# EAGLE design Secondary (EAGLE 5.12)

## Sheet 1 of 3
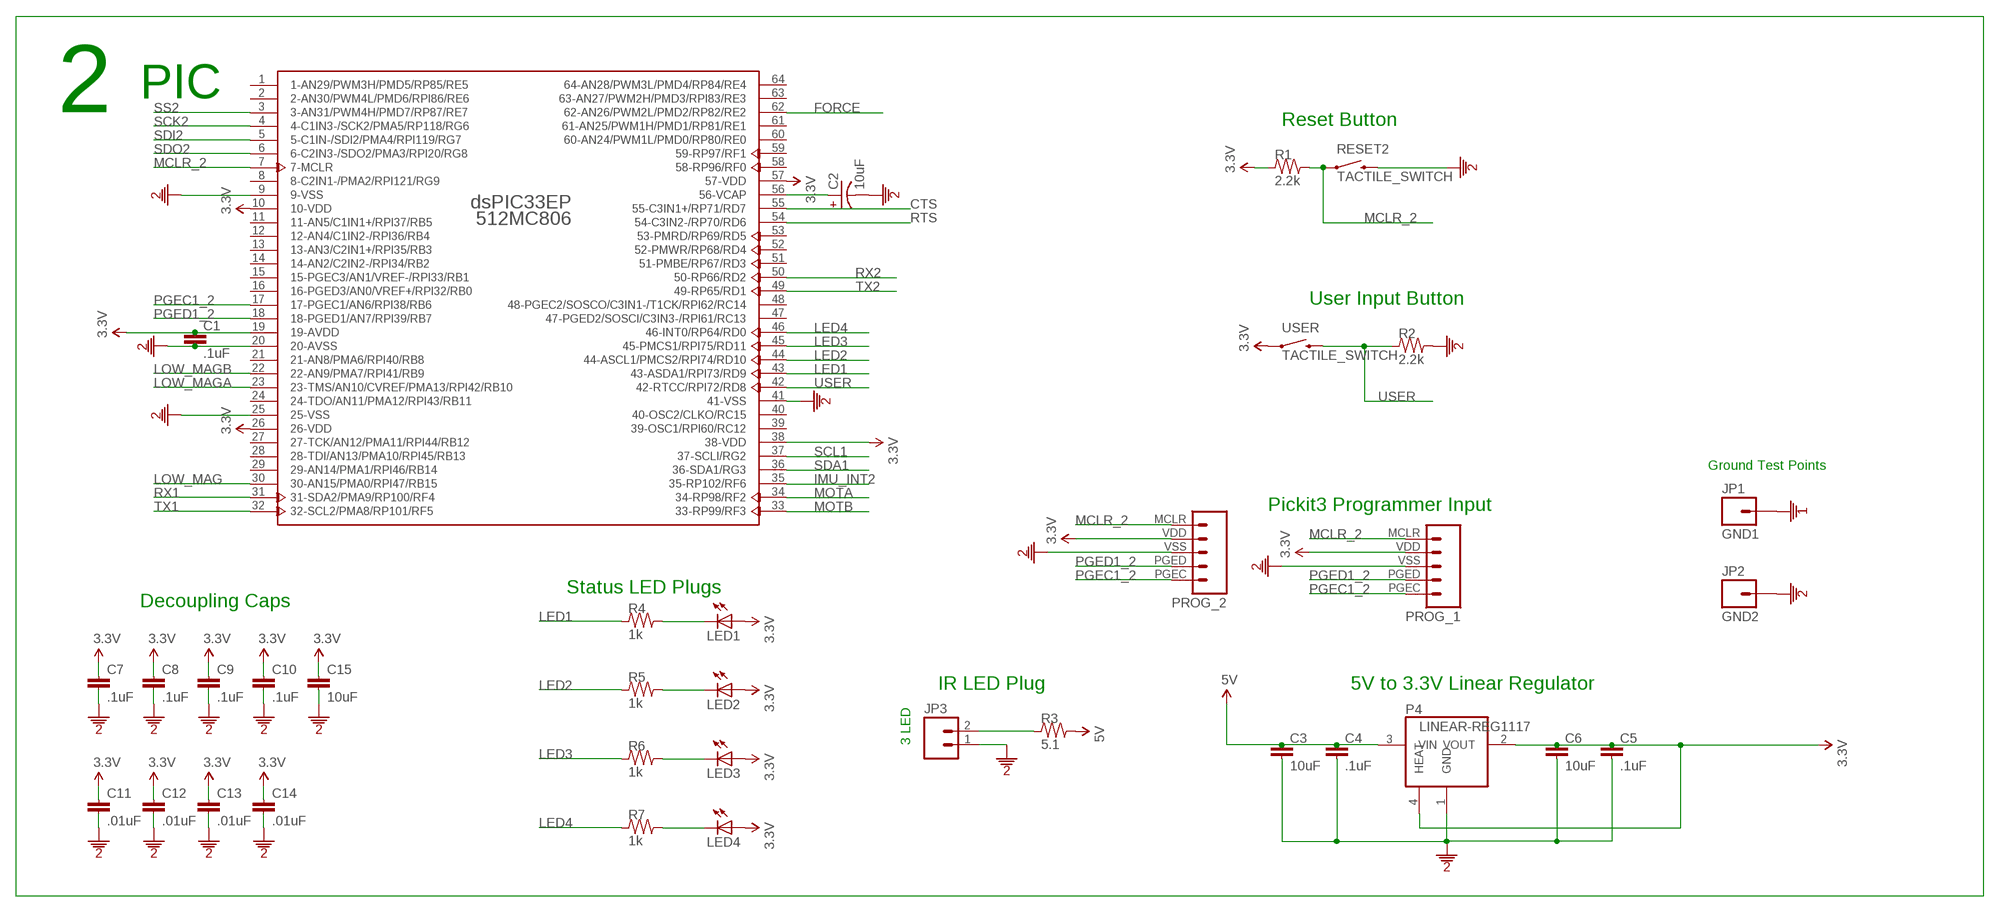
[diagram p0: schematic, sheet 1]

### Parts
C1  .1uF  CAP0603  [0603]
C2  10uF  CAP-POL0603  [0603-POL]
C3  10uF  CAP1206  [1206]
C4  .1uF  CAP0603  [0603]
C5  .1uF  CAP0603  [0603]
C6  10uF  CAP1206  [1206]
C7  .1uF  CAP0603  [0603]
C8  .1uF  CAP0603  [0603]
C9  .1uF  CAP0603  [0603]
C10  .1uF  CAP0603  [0603]
C11  .01uF  CAP0603  [0603]
C12  .01uF  CAP0603  [0603]
C13  .01uF  CAP0603  [0603]
C14  .01uF  CAP0603  [0603]
C15  10uF  CAP1206  [1206]
JP1  GND1  M01PTH  [1X01]
JP2  GND2  M01PTH  [1X01]
JP3  M02JST-PH-V  [JST-2-PH-V]
LED1  LED0603  [0603-DIODE]
LED2  LED0603  [0603-DIODE]
LED3  LED0603  [0603-DIODE]
LED4  LED0603  [0603-DIODE]
P4  LINEAR-REG1117  [SOT223]
PROG_1  M05PICKIT3  [1X05-PICKIT3]
PROG_2  M05PICKIT3  [1X05-PICKIT3]
R1  2.2k  R0603  [0603]
R2  2.2k  R0603  [0603]
R3  5.1  R0603  [0603]
R4  1k  R0603  [0603]
R5  1k  R0603  [0603]
R6  1k  R0603  [0603]
R7  1k  R0603  [0603]
RESET2  TACTILE_SWITCH  [TACTILE_SWITCH]
U$1  DSPIC33EP512MC806  [TQFP64_10X10]
USER  TACTILE_SWITCH  [TACTILE_SWITCH]

### Nets
3.3V: C1.1 C5.1 C6.1 C7.1 C8.1 C9.1 C10.1 C11.1 C12.1 C13.1 C14.1 C15.1 LED1.AN(A) LED2.AN(A) LED3.AN(A) LED4.AN(A) P4.2(VOUT) P4.4(HEAT) PROG_1.VDD PROG_2.VDD R1.1 U$1.10(10-VDD) U$1.19(19-AVDD) U$1.26(26-VDD) U$1.38(38-VDD) U$1.57(57-VDD) USER.1 ; also sheet 2
5V: C3.1 C4.1 P4.3(VIN) R3.2 ; also sheet 2,3
CTS: U$1.55(55-C3IN1+/RP71/RD7) ; also sheet 2
FORCE: U$1.62(62-AN26/PWM2L/PMD2/RP82/RE2) ; also sheet 2
GND1: JP1.1 ; also sheet 2,3
GND2: C1.2 C2.- C3.2 C4.2 C5.2 C6.2 C7.2 C8.2 C9.2 C10.2 C11.2 C12.2 C13.2 C14.2 C15.2 JP2.1 JP3.1 P4.1(GND) PROG_1.VSS PROG_2.VSS R2.2 RESET2.2 U$1.9(9-VSS) U$1.20(20-AVSS) U$1.25(25-VSS) U$1.41(41-VSS) ; also sheet 2,3
IMU_INT2: U$1.35(35-RP102/RF6) ; also sheet 2
LED1: R4.1 U$1.43(43-ASDA1/RPI73/RD9)
LED2: R5.1 U$1.44(44-ASCL1/PMCS2/RPI74/RD10)
LED3: R6.1 U$1.45(45-PMCS1/RPI75/RD11)
LED4: R7.1 U$1.46(46-INT0/RP64/RD0)
LOW_MAG: U$1.30(30-AN15/PMA0/RPI47/RB15) ; also sheet 2
LOW_MAGA: U$1.23(23-TMS/AN10/CVREF/PMA13/RPI42/RB10) ; also sheet 2
LOW_MAGB: U$1.22(22-AN9/PMA7/RPI41/RB9) ; also sheet 2
MCLR_2: PROG_1.MCLR PROG_2.MCLR R1.2 RESET2.1 U$1.7(7-MCLR)
MOTA: U$1.34(34-RP98/RF2) ; also sheet 2
MOTB: U$1.33(33-RP99/RF3) ; also sheet 2
N$2: C2.+ U$1.56(56-VCAP)
N$3: JP3.2 R3.1
N$6: LED4.CAT(C) R7.2
N$7: LED3.CAT(C) R6.2
N$8: LED2.CAT(C) R5.2
N$9: LED1.CAT(C) R4.2
PGEC1_2: PROG_1.PGEC PROG_2.PGEC U$1.17(17-PGEC1/AN6/RPI38/RB6)
PGED1_2: PROG_1.PGED PROG_2.PGED U$1.18(18-PGED1/AN7/RPI39/RB7)
RTS: U$1.54(54-C3IN2-/RP70/RD6) ; also sheet 2
RX1: U$1.31(31-SDA2/PMA9/RP100/RF4) ; also sheet 2
RX2: U$1.50(50-RP66/RD2) ; also sheet 2
SCK2: U$1.4(4-C1IN3-/SCK2/PMA5/RP118/RG6) ; also sheet 2
SCL1: U$1.37(37-SCLI/RG2) ; also sheet 2
SDA1: U$1.36(36-SDA1/RG3) ; also sheet 2
SDI2: U$1.5(5-C1IN-/SDI2/PMA4/RPI119/RG7) ; also sheet 2
SDO2: U$1.6(6-C2IN3-/SDO2/PMA3/RPI20/RG8) ; also sheet 2
SS2: U$1.3(3-AN31/PWM4H/PMD7/RP87/RE7) ; also sheet 2
TX1: U$1.32(32-SCL2/PMA8/RP101/RF5) ; also sheet 2
TX2: U$1.49(49-RP65/RD1) ; also sheet 2
USER: R2.1 U$1.42(42-RTCC/RPI72/RD8) USER.2
Unconnected: U$1.1(1-AN29/PWM3H/PMD5/RP85/RE5) U$1.2(2-AN30/PWM4L/PMD6/RPI86/RE6) U$1.8(8-C2IN1-/PMA2/RPI121/RG9) U$1.11(11-AN5/C1IN1+/RPI37/RB5) U$1.12(12-AN4/C1IN2-/RPI36/RB4) U$1.13(13-AN3/C2IN1+/RPI35/RB3) U$1.14(14-AN2/C2IN2-/RPI34/RB2) U$1.15(15-PGEC3/AN1/VREF-/RPI33/RB1) U$1.16(16-PGED3/AN0/VREF+/RPI32/RB0) U$1.21(21-AN8/PMA6/RPI40/RB8) U$1.24(24-TDO/AN11/PMA12/RPI43/RB11) U$1.27(27-TCK/AN12/PMA11/RPI44/RB12) U$1.28(28-TDI/AN13/PMA10/RPI45/RB13) U$1.29(29-AN14/PMA1/RPI46/RB14) U$1.39(39-OSC1/RPI60/RC12) U$1.40(40-OSC2/CLKO/RC15) U$1.47(47-PGED2/SOSCI/C3IN3-/RPI61/RC13) U$1.48(48-PGEC2/SOSCO/C3IN1-/T1CK/RPI62/RC14) U$1.51(51-PMBE/RP67/RD3) U$1.52(52-PMWR/RP68/RD4) U$1.53(53-PMRD/RP69/RD5) U$1.58(58-RP96/RF0) U$1.59(59-RP97/RF1) U$1.60(60-AN24/PWM1L/PMD0/RP80/RE0) U$1.61(61-AN25/PWM1H/PMD1/RP81/RE1) U$1.63(63-AN27/PWM2H/PMD3/RPI83/RE3) U$1.64(64-AN28/PWM3L/PMD4/RP84/RE4)

### Notes on the sheet
- 2 | PIC
- Reset Button
- User Input Button
- Ground Test Points
- Pickit3 Programmer Input
- Status LED Plugs
- Decoupling Caps
- IR LED Plug | 5V to 3.3V Linear Regulator
- 3 LED

## Sheet 2 of 3
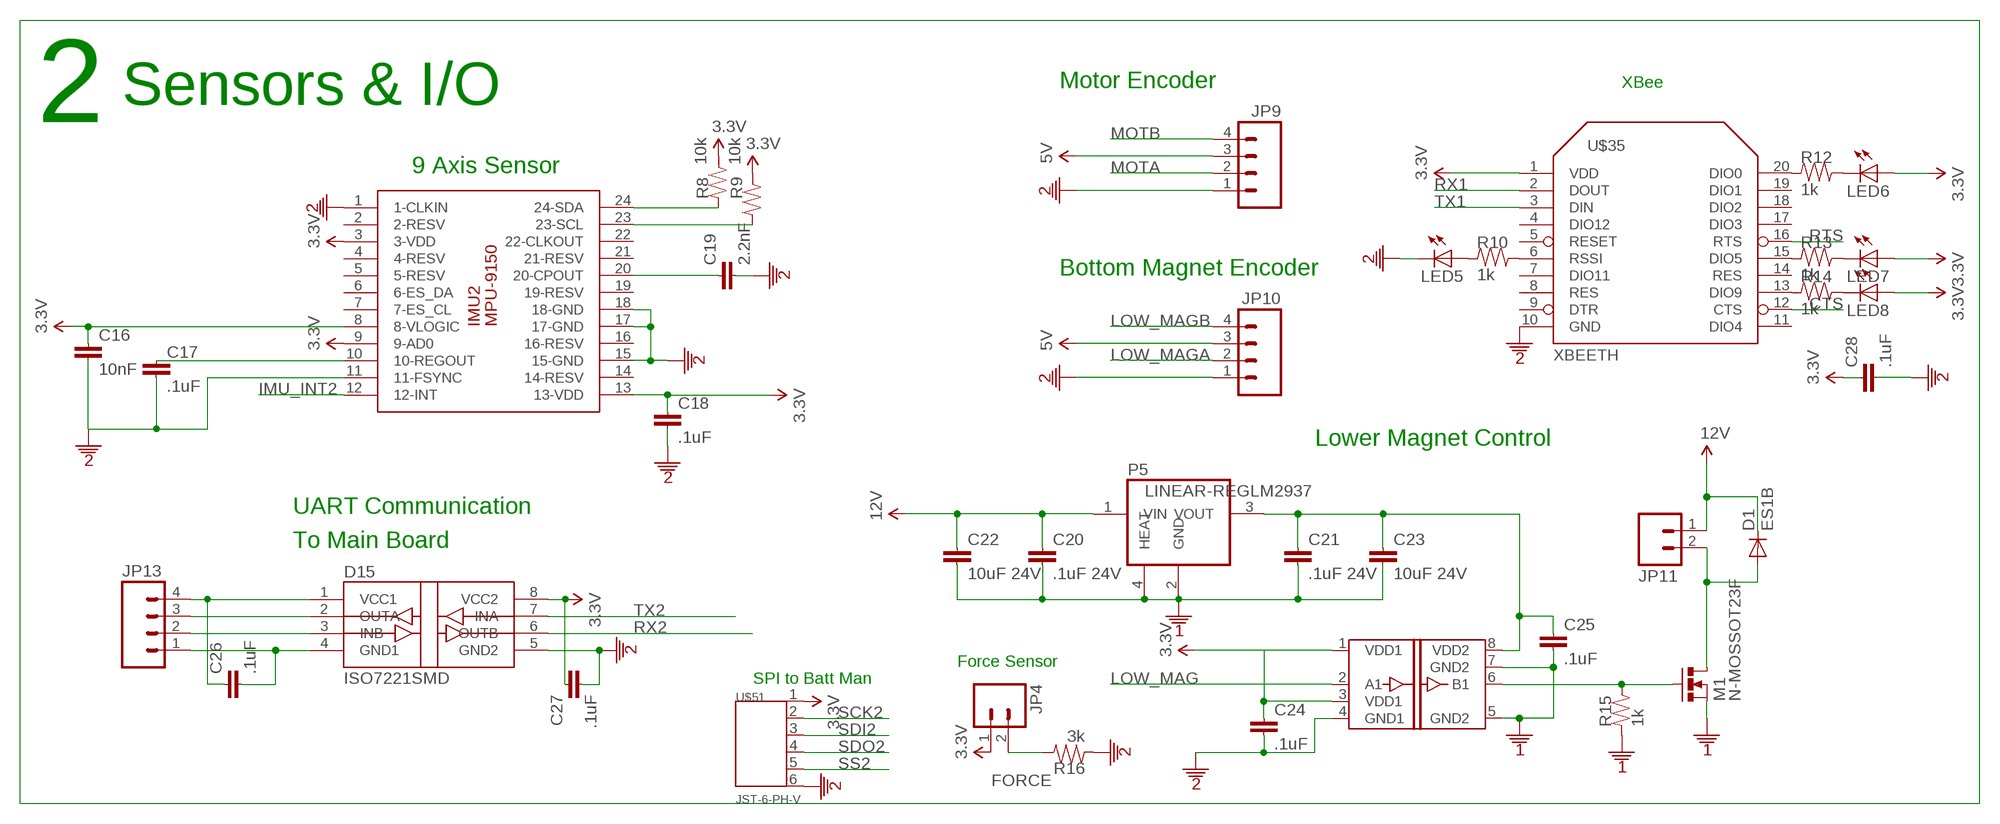
[diagram p1: schematic, sheet 2]

### Parts
C16  10nF  CAP0603  [0603]
C17  .1uF  CAP0603  [0603]
C18  .1uF  CAP0603  [0603]
C19  2.2nF  CAP0603  [0603]
C20  .1uF 24V  CAP0603  [0603]
C21  .1uF 24V  CAP0603  [0603]
C22  10uF 24V  CAP1206  [1206]
C23  10uF 24V  CAP1206  [1206]
C24  .1uF  CAP0603  [0603]
C25  .1uF  CAP0603  [0603]
C26  .1uF  CAP0603  [0603]
C27  .1uF  CAP0603  [0603]
C28  .1uF  CAP1206  [1206]
D1  ES1B  DIODESMA  [SMA-DIODE]
D13  DIGITAL-ISOLATOR-1CHSOIC8-N  [SOIC8-N]
D15  ISO7221SMD  [SOIC-8]
IMU2  MPU-9150  [LGA24_4X4]
JP4  M02JST-PH-V  [JST-2-PH-V]
JP9  M04JST-PH-V  [JST-4-PH-V]
JP10  M04JST-PH-V  [JST-4-PH-V]
JP11  M02JST-PH-V  [JST-2-PH-V]
JP13  M04JST-PH-V  [JST-4-PH-V]
LED5  LED0603  [0603-DIODE]
LED6  LED0603  [0603-DIODE]
LED7  LED0603  [0603-DIODE]
LED8  LED0603  [0603-DIODE]
M1  N-MOSSOT23F  [SOT23F]
P5  LINEAR-REGLM2937  [SOT223]
R8  10k  R0402  [0402]
R9  10k  R0402  [0402]
R10  1k  R0603  [0603]
R12  1k  R0603  [0603]
R13  1k  R0603  [0603]
R14  1k  R0603  [0603]
R15  1k  R0603  [0603]
R16  3k  R0603  [0603]
U$35  XBEETH  [XBEE-SILK]
U$51  JST-6-PH-V  [JST-6-PH-V]

### Nets
3.3V: C16.1 C18.1 C24.1 C27.1 C28.1 D13.1(VDD1) D13.3(VDD1) D15.8(VCC2) IMU2.3(3-VDD) IMU2.8(8-VLOGIC) IMU2.9(9-AD0) IMU2.13(13-VDD) JP4.1 LED6.AN(A) LED7.AN(A) LED8.AN(A) R8.2 R9.2 U$35.1(VDD) U$51.1 ; also sheet 1
5V: JP9.3 JP10.3 ; also sheet 1,3
12V: C20.1 C22.1 D1.C JP11.1 P5.1(VIN) ; also sheet 3
CTS: U$35.12(CTS) ; also sheet 1
FORCE: JP4.2 R16.2 ; also sheet 1
GND1: C20.2 C21.2 C22.2 C23.2 C25.2 D13.5(GND2) D13.7(GND2) M1.S P5.2(GND) P5.4(HEAT) R15.1 ; also sheet 1,3
GND2: C16.2 C17.2 C18.2 C19.2 C24.2 C27.2 C28.2 D13.4(GND1) D15.5(GND2) IMU2.1(1-CLKIN) IMU2.11(11-FSYNC) IMU2.15(15-GND) IMU2.17(17-GND) IMU2.18(18-GND) JP9.1 JP10.1 LED5.CAT(C) R16.1 U$35.10(GND) U$51.6 ; also sheet 1,3
IMU_INT2: IMU2.12(12-INT) ; also sheet 1
LOW_MAG: D13.2(A1) ; also sheet 1
LOW_MAGA: JP10.2 ; also sheet 1
LOW_MAGB: JP10.4 ; also sheet 1
MOTA: JP9.2 ; also sheet 1
MOTB: JP9.4 ; also sheet 1
N$11: C17.1 IMU2.10(10-REGOUT)
N$14: C19.1 IMU2.20(20-CPOUT)
N$15: C21.1 C23.1 C25.1 D13.8(VDD2) P5.3(VOUT)
N$17: D13.6(B1) M1.G R15.2
N$18: D1.A JP11.2 M1.D
N$19: C26.1 D15.1(VCC1) JP13.4
N$20: D15.2(OUTA) JP13.3
N$21: D15.3(INB) JP13.2
N$22: C26.2 D15.4(GND1) JP13.1
N$23: R10.2 U$35.6(RSSI)
N$25: R12.1 U$35.20(DIO0)
N$26: R13.1 U$35.15(DIO5)
N$27: R14.1 U$35.13(DIO9)
N$28: LED5.AN(A) R10.1
N$29: LED6.CAT(C) R12.2
N$30: LED7.CAT(C) R13.2
N$31: LED8.CAT(C) R14.2
RTS: U$35.16(RTS) ; also sheet 1
RX1: U$35.2(DOUT) ; also sheet 1
RX2: D15.6(OUTB) ; also sheet 1
SCK2: U$51.2 ; also sheet 1
SCL1: IMU2.23(23-SCL) R9.1 ; also sheet 1
SDA1: IMU2.24(24-SDA) R8.1 ; also sheet 1
SDI2: U$51.3 ; also sheet 1
SDO2: U$51.4 ; also sheet 1
SS2: U$51.5 ; also sheet 1
TX1: U$35.3(DIN) ; also sheet 1
TX2: D15.7(INA) ; also sheet 1
Unconnected: IMU2.2(2-RESV) IMU2.4(4-RESV) IMU2.5(5-RESV) IMU2.6(6-ES_DA) IMU2.7(7-ES_CL) IMU2.14(14-RESV) IMU2.16(16-RESV) IMU2.19(19-RESV) IMU2.21(21-RESV) IMU2.22(22-CLKOUT) U$35.4(DIO12) U$35.5(RESET) U$35.7(DIO11) U$35.8(RES) U$35.9(DTR) U$35.11(DIO4) U$35.14(RES) U$35.17(DIO3) U$35.18(DIO2) U$35.19(DIO1)

### Notes on the sheet
- Motor Encoder | XBee
- 2 | Sensors & I/O
- 9 Axis Sensor
- Bottom Magnet Encoder
- Lower Magnet Control
- UART Communication
- To Main Board
- Force Sensor
- SPI to Batt Man

## Sheet 3 of 3
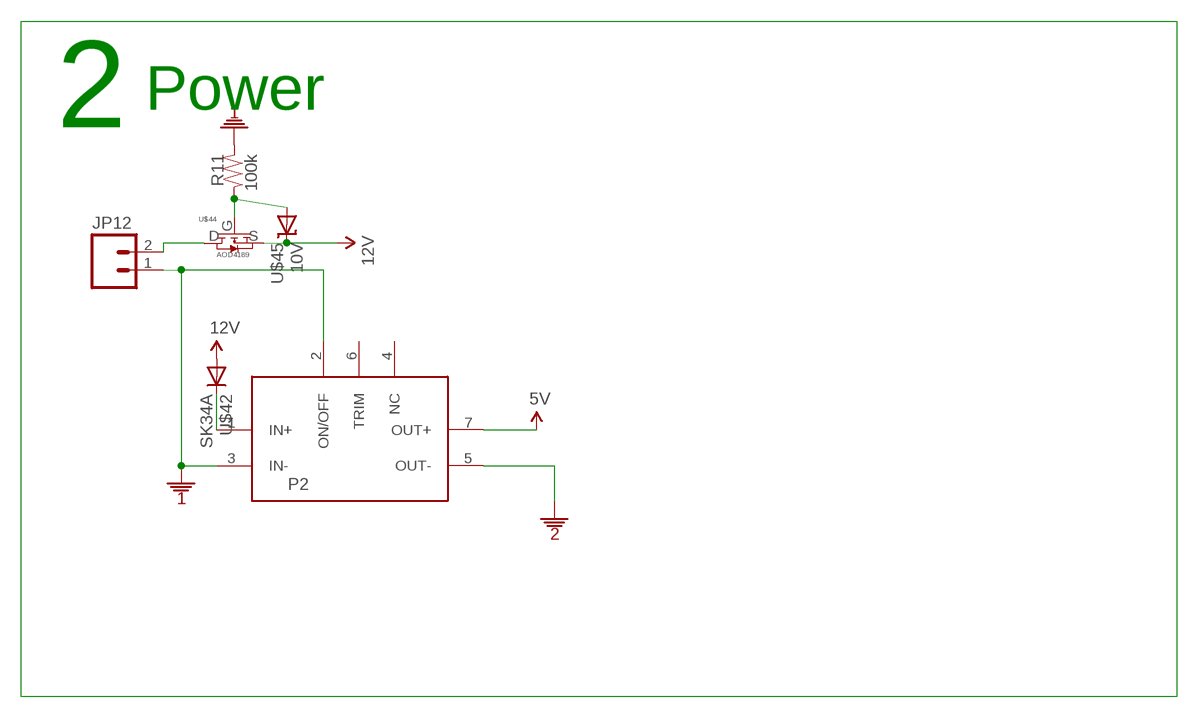
[diagram p2: schematic, sheet 3]

### Parts
JP12  M02JST-PH-V  [JST-2-PH-V]
P2  DC-DC-CONVERTER1.2A  [CC6-2405SF-E]
R11  100k  R0603  [0603]
U$42  SK34A  DIODESMA  [SMA-DIODE]
U$44  AOD4189  [D-PAK]
U$45  10V  DIODE-ZENERSMB  [SMB-DIODE]

### Nets
5V: P2.7(OUT+) ; also sheet 1,2
12V: U$42.A U$44.S U$45.C ; also sheet 2
GND1: JP12.1 P2.2(ON/OFF) P2.3(IN-) R11.1 ; also sheet 1,2
GND2: P2.5(OUT-) ; also sheet 1,2
N$12: P2.1(IN+) U$42.C
N$13: R11.2 U$44.G U$45.A
N$24: JP12.2 U$44.D
Unconnected: P2.4(NC) P2.6(TRIM)

### Notes on the sheet
- 2 | Power

## Library data of the parts
C1 C3-C28 = GibbotV5:CAP: Capacitor Standard 0603 ceramic capacitor, and 0.1" leaded capacitor.
C2 = GibbotV5:CAP-POL: CAPACITOR, American symbol
D1 U$42 = GibbotV5:DIODE: Diode These are standard reverse protection diodes and small signal diodes. SMA package can handle up to about 1A. SOD-323 can handle about 200mA. What the SOD-323 package when ordering, there are some mfgs out there that are 5-pin packages.
D13 = GibbotV5:DIGITAL-ISOLATOR-1CH
D15 = GibbotV6:ISO7221
IMU2 = GibbotV5:MPU-9150
JP1 JP2 = GibbotV5:M01: Header 1 Standard 1-pin 0.1" header. Use with straight break away headers (SKU : PRT-00116), right angle break away headers (PRT-00553), swiss pins (PRT-00743), machine pins (PRT-00117), and female headers (PRT-00115).
JP3 JP4 JP11 JP12 = GibbotV5:M02: Header 2 Standard 2-pin 0.1" header. Use with straight break away headers (SKU : PRT-00116), right angle break away headers (PRT-00553), swiss pins (PRT-00743), machine pins (PRT-00117), and female headers (PRT-00115). Molex polarized connector foot print use with SKU : PRT-08233 with associated crimp pins and housings.
JP9 JP10 JP13 = GibbotV5:M04: Header 4 Standard 4-pin 0.1" header. Use with straight break away headers (SKU : PRT-00116), right angle break away headers (PRT-00553), swiss pins (PRT-00743), machine pins (PRT-00117), and female headers (PRT-00115). Molex polarized connector foot print use with SKU : PRT-08231 with associated crimp pins and housings. 1MM SMD Version SKU: PRT-10208
LED1-LED8 = GibbotV5:LED: LEDs Standard schematic elements and footprints for 5mm, 3mm, 1206, and 0603 sized LEDs. 5mm - Spark Fun Electronics SKU : COM-00529 (and others)
M1 = GibbotV5:N-MOS
P2 = GibbotV5:DC-DC-CONVERTER
P4 P5 = GibbotV5:LINEAR-REG
PROG_1 PROG_2 = GibbotV5:M05: Header 5 Standard 5-pin 0.1" header. Use with straight break away headers (SKU : PRT-00116), right angle break away headers (PRT-00553), swiss pins (PRT-00743), machine pins (PRT-00117), and female headers (PRT-00115). Molex polarized connector foot print use with SKU : PRT-08230 with associated crimp pins and housings.
R1-R16 = GibbotV5:R: RESISTOR, American symbol
RESET2 USER = GibbotV5:TACTILE_SWITCH
U$1 = GibbotV5:DSPIC33EP512MC806
U$35 = GibbotV5:XBEE
U$44 = GibbotV6:AOD4189
U$45 = GibbotV5:DIODE-ZENER: Zener Diode Production Part - 8199 3.4V Zener Voltage
U$51 = GibbotV6:JST-6-PH-V

## Board
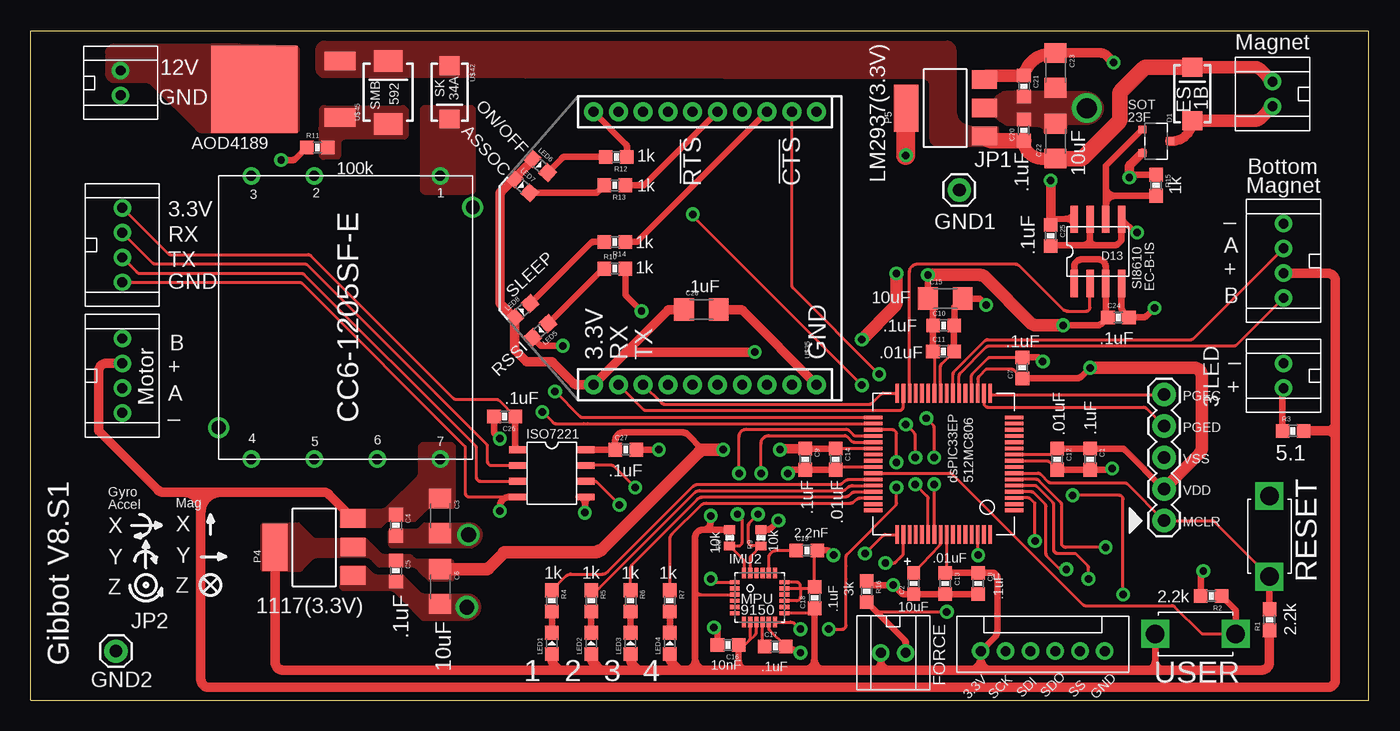
[diagram p3: board, top side]
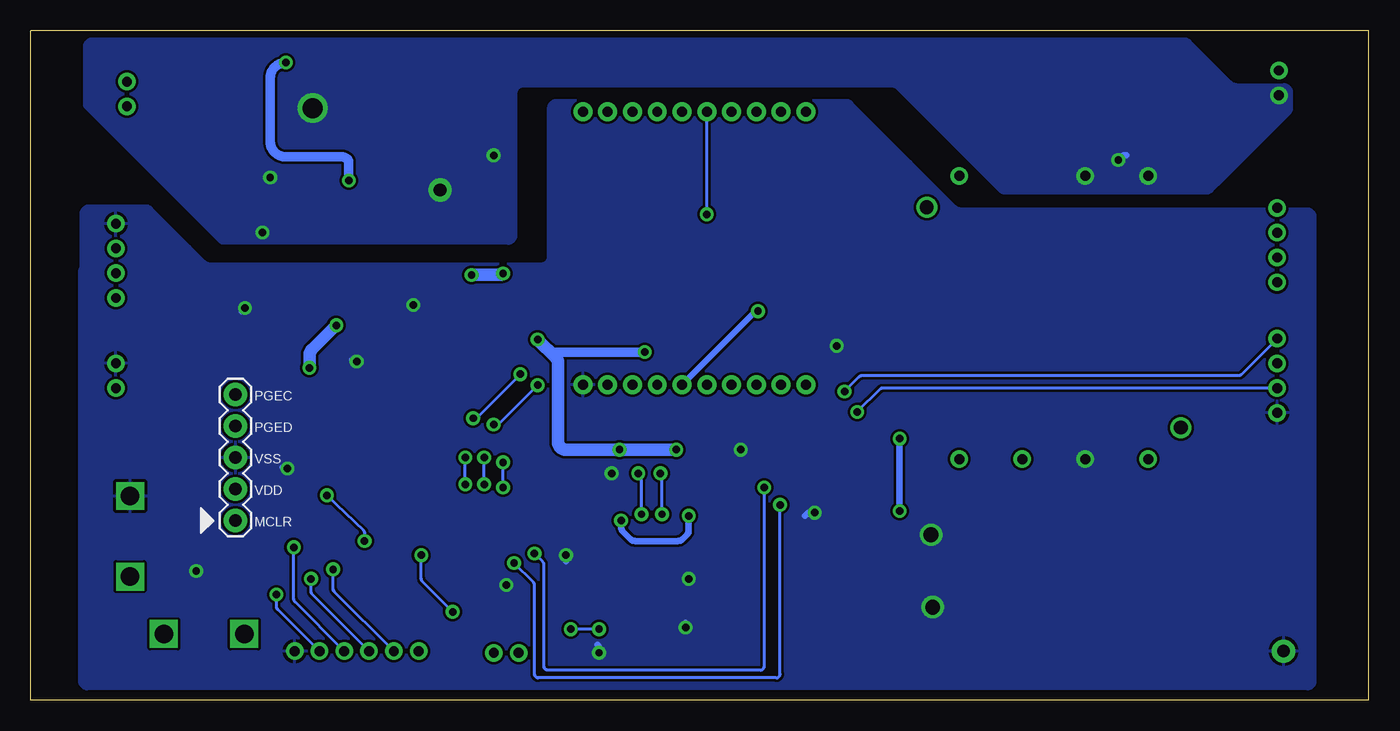
[diagram p4: board, bottom side, seen from below]

Size 107.95 x 53.98 mm. Coordinates in mm from the lower left corner, seen from the top.
Outline: 0,0 0,53.98 107.95,53.98 107.95,0 0,0
Copper layers (1*16): Top 0.035mm / dielectric 1.5mm / Bottom 0.035mm
Design rules "default *": minimum track width 8mil, minimum drill 20mil, track to track 8mil, track to pad 8mil, pad to pad 2mil, via to via 8mil, smd to smd 8mil, copper to edge 10mil, drill to drill 8mil, minimum pad ring 12mil, minimum via ring 10mil, stop-mask expansion 4mil, vias tented up to drill 0mil, thermal gap 10mil

### Footprints (pad centres in the part's own frame; a part is rotated, then mirrored left to right if it is on the bottom)
0603 = smd 1.1 x 1.1: 1 -0.85,0; 2 0.85,0
0603-POL = smd 1.1 x 1: + 0.85,0; - -0.85,0
1206 = smd 1.6 x 1.8: 1 -1.4,0; 2 1.4,0
SMA-DIODE = smd 1.52 x 1.63: A -2.15,0; C 2.15,0
SOIC8-N = smd 2.2 x 0.6: 1 -2.6,1.905; 2 -2.6,0.635; 3 -2.6,-0.635; 4 -2.6,-1.905; 5 2.6,-1.905; 6 2.6,-0.635; 7 2.6,0.635; 8 2.6,1.905
SOIC-8 = smd 1.5 x 0.55: 1 -2.7,1.905; 2 -2.7,0.635; 3 -2.7,-0.635; 4 -2.7,-1.905; 5 2.7,-1.905; 6 2.7,-0.635; 7 2.7,0.635; 8 2.7,1.905
LGA24_4X4 = smd 0.8 x 0.35: 1 -2,1.25; 2 -2,0.75; 3 -2,0.25; 4 -2,-0.25; 5 -2,-0.75; 6 -2,-1.25; 13 2,-1.25; 14 2,-0.75; 15 2,-0.25; 16 2,0.25; 17 2,0.75; 18 2,1.25 | smd 0.35 x 0.85: 7 -1.25,-1.975; 8 -0.75,-1.975; 9 -0.25,-1.975; 10 0.25,-1.975; 11 0.75,-1.975; 12 1.25,-1.975; 19 1.25,1.975; 20 0.75,1.975; 21 0.25,1.975; 22 -0.25,1.975; 23 -0.75,1.975; 24 -1.25,1.975
1X01 = drill 1.016 pad 1.88 round: 1 0,0
JST-2-PH-V = drill 0.8 round: 1 -1,0; 2 1,0
JST-4-PH-V = drill 0.8 round: 1 -3,0; 2 -1,0; 3 1,0; 4 3,0
0603-DIODE = smd 1.1 x 1.1: AN -0.85,0; CAT 0.85,0
SOT23F = smd 0.6 x 0.65: D 0,1.125; G -0.95,-1.125; S 0.95,-1.125
CC6-2405SF-E = drill 0.8 round: 1 -11.43,7.62; 2 -11.43,-2.54; 3 -11.43,-7.62; 4 11.43,-7.62; 5 11.43,-2.54; 6 11.43,2.54; 7 11.43,7.62 | drill 1.1 round: P$9 8.89,-10.25; P$10 -8.89,10.25
SOT223 = smd 1.499 x 2.007: 1 -2.261,-3.15; 2 0.025,-3.15; 3 2.311,-3.15 | smd 3.81 x 2.007: 4 0,3.15
1X05-PICKIT3 = drill 1.016 pad 1.88 round: MCLR 1.27,-1.016; PGEC 11.43,-1.016; PGED 8.89,-1.016; VDD 3.81,-1.016; VSS 6.35,-1.016
0402 = smd 0.7 x 0.9: 1 -0.65,0; 2 0.65,0
TACTILE_SWITCH = drill 1.5 square: 1 -3.25,0; 2 3.25,0
TQFP64_10X10 = smd 1.5 x 0.3: 1 -5.7,3.75; 2 -5.7,3.25; 3 -5.7,2.75; 4 -5.7,2.25; 5 -5.7,1.75; 6 -5.7,1.25; 7 -5.7,0.75; 8 -5.7,0.25; 9 -5.7,-0.25; 10 -5.7,-0.75; 11 -5.7,-1.25; 12 -5.7,-1.75; 13 -5.7,-2.25; 14 -5.7,-2.75; 15 -5.7,-3.25; 16 -5.7,-3.75; 33 5.7,-3.75; 34 5.7,-3.25; 35 5.7,-2.75; 36 5.7,-2.25; 37 5.7,-1.75; 38 5.7,-1.25; 39 5.7,-0.75; 40 5.7,-0.25; 41 5.7,0.25; 42 5.7,0.75; 43 5.7,1.25; 44 5.7,1.75; 45 5.7,2.25; 46 5.7,2.75; 47 5.7,3.25; 48 5.7,3.75 | smd 0.3 x 1.5: 17 -3.75,-5.7; 18 -3.25,-5.7; 19 -2.75,-5.7; 20 -2.25,-5.7; 21 -1.75,-5.7; 22 -1.25,-5.7; 23 -0.75,-5.7; 24 -0.25,-5.7; 25 0.25,-5.7; 26 0.75,-5.7; 27 1.25,-5.7; 28 1.75,-5.7; 29 2.25,-5.7; 30 2.75,-5.7; 31 3.25,-5.7; 32 3.75,-5.7; 49 3.75,5.7; 50 3.25,5.7; 51 2.75,5.7; 52 2.25,5.7; 53 1.75,5.7; 54 1.25,5.7; 55 0.75,5.7; 56 0.25,5.7; 57 -0.25,5.7; 58 -0.75,5.7; 59 -1.25,5.7; 60 -1.75,5.7; 61 -2.25,5.7; 62 -2.75,5.7; 63 -3.25,5.7; 64 -3.75,5.7
XBEE-SILK = drill 0.8 pad 1.524 round: 1 -11,20; 2 -11,18; 3 -11,16; 4 -11,14; 5 -11,12; 6 -11,10; 7 -11,8; 8 -11,6; 9 -11,4; 10 -11,2; 11 11,2; 12 11,4; 13 11,6; 14 11,8; 15 11,10; 16 11,12; 17 11,14; 18 11,16; 19 11,18; 20 11,20
D-PAK = smd 7.01 x 7.01: D 0,0 | smd 1.499 x 2.515: G -2.286,-6.909; S 2.286,-6.909
SMB-DIODE = smd 1.75 x 2.3: A -2.54,0; C 2.54,0
JST-6-PH-V = drill 0.8 round: 1 -5,0; 2 -3,0; 3 -1,0; 4 1,0; 5 3,0; 6 5,0

### Placement (x,y rotation side)
C1  85.47,19.43 270 top
C2  71.25,9.4 90 top
C3  33.02,14.86 270 top
C4  29.46,14.1 270 top
C5  29.46,10.41 270 top
C6  33.02,9.14 270 top
C7  80.01,26.8 90 top
C8  76.45,9.4 270 top
C9  62.48,19.43 270 top
C10  73.66,30.23 0 top
C11  73.65,28.13 0 top
C12  82.8,19.43 270 top
C13  73.79,9.4 270 top
C14  64.95,19.43 270 top
C15  73.79,32.38 0 top
C16  56.26,4.45 180 top
C17  60.07,4.32 0 top
C18  63.25,8.26 90 top
C19  62.61,12.06 0 top
C20  80.14,45.97 90 top
C21  80.14,49.53 270 top
C22  82.68,45.09 90 top
C23  82.68,50.8 270 top
C24  87.76,30.86 0 top
C25  82.3,37.47 270 top
C26  38.23,22.86 180 top
C27  48.01,20.19 0 top
C28  54.1,31.5 0 top
D1  93.73,48.9 90 top
D13  86.11,36.2 90 top
D15  42.04,18.29 0 top
IMU2  58.8,8.26 0 top
JP1  74.93,41.15 0 top
JP2  6.86,3.94 0 top
JP3  101.09,26.16 270 top
JP4  69.6,3.81 0 top
JP9  7.37,26.16 90 top
JP10  101.09,35.43 270 top
JP11  100.2,48.9 270 top
JP12  7.24,49.78 90 top
JP13  7.37,36.7 90 top
LED1  42.04,4.57 90 top
LED2  45.21,4.57 90 top
LED3  48.39,4.57 90 top
LED4  51.56,4.57 90 top
LED5  41.1,29.81 222 top
LED6  41.06,43.12 318 top
LED7  39.63,41.49 318 top
LED8  39.66,31.41 42 top
M1  90.81,45.09 270 top
P2  25.4,30.86 270 top
P4  22.86,12.32 90 top
P5  73.79,47.75 90 top
PROG_1  90.42,13.21 90 top
PROG_2  92.46,13.21 90 bottom
R1  99.95,6.48 90 top
R2  95.25,8.38 180 top
R3  101.85,21.72 0 top
R4  42.04,8 270 top
R5  45.21,8 270 top
R6  48.39,8 270 top
R7  51.56,8 270 top
R8  56.39,13.08 90 top
R9  58.93,13.08 90 top
R10  47.12,34.8 0 top
R11  23.11,44.58 0 top
R12  47.24,43.81 180 top
R13  47.12,41.53 180 top
R14  47.12,36.96 180 top
R15  90.81,41.53 270 top
R16  67.44,8.76 270 top
RESET2  99.95,13.21 90 top
U$1  73.66,19.05 180 top
U$35  65.41,36.45 90 top
U$42  33.78,49.02 270 top
U$44  18.03,49.28 90 top
U$45  28.83,49.02 90 top
U$51  81.66,3.94 0 top
USER  93.98,5.33 0 top

### Tracks (layer width: path | path; a pad name or v marks a point on that pad's centre or on a via)
3.3V  (via drill 0.6)
  Top 0.254: IMU2.8 58.05,5.01 arc-45 57.96,4.78 | 57.11,3.94 57.96,4.78 | IMU2.9 58.55,5.51 arc-45 58.46,5.28 57.96,4.78 | 53.59,9.02 arc90 54.11,8.51 | IMU2.3 53.97,8.51 arc90 53.59,8.13 | U$1.10 82.19,19.8 arc45 82.42,19.89 C12.1 | U$1.26 72.91,27.89 arc45 72.82,28.11 C11.1 | U$1.38 64.99,20.3 arc45 C14.1 | 73.91,10.63 U$1.57 | IMU2.13 62.72,7 arc45 62.94,7.1 C18.1 | U$1.19 76.41,25.86 arc-45 76.5,26.08 77.09,26.67 79.16,26.67 arc-45 79.38,26.58 C7.1
  Top 0.279: 73.91,10.63 arc-45 73.82,10.4 C13.1
  Top 0.508: D15.8 C27.1 47.16,20.95 arc-90 47.79,21.59 52.57,21.59 arc-45 53.02,21.4 54.13,20.29 arc45 54.37,20.19 | 56.26,2.41 arc90 57.11,3.26 | C16.1 57.11,3.94 57.11,3.21 arc90 57.91,2.41 | 62.23,2.41 arc90 63.25,3.43 | C18.1 63.25,3.3 arc90 64.14,2.41 | 54.23,13.73 R8.2 | 54.23,13.73 arc90 53.59,13.1 53.59,9.02 53.59,8.13 53.59,3.43 arc90 54.61,2.41 | 52.7,2.41 arc90 53.59,3.3 | 54.23,13.73 arc90 54.86,14.37 v54.86,14.86 | v60.33,14.48 59.67,13.82 arc-45 59.45,13.73 R9.2 | C9.1 C14.1 | C13.1 C8.1 77.66,10.25 arc-90 77.98,9.93 77.98,5.52 arc-45 77.79,5.07 U$51.1 76.66,3.48 arc90 77.72,2.41 | C12.1 C1.1 88.05,20.28 arc-45 88.27,20.19 PROG_2.VDD | C11.1 72.8,30.2 arc-45 C10.1 72.81,31.83 arc45 72.72,32.05 C15.1 v72.39,34.28 arc-45 v72.39,34.29 | D13.1 84.2,34.92 arc-90 84.84,35.56 86.11,35.56 arc-90 86.74,34.92 D13.3 86.74,31.26 arc45 C24.1 86.46,30.41 arc-45 86.01,30.23 v83.31,30.23 | 89.92,2.41 arc90 90.73,3.23 | USER.1 90.73,3.25 arc90 91.57,2.41 | 67.82,2.41 arc90 68.6,3.19 | JP4.1 68.6,3.29 arc90 69.47,2.41 | 75.56,2.41 arc90 76.66,3.51 | C7.1 84.36,25.95 arc45 84.81,26.13 v85.47,26.8
  Top 0.762: P4.4 19.71,3.05 arc90 20.34,2.41 42.67,2.41 | 42.67,2.41 45.97,2.41 | 45.97,2.41 49.02,2.41 | 49.02,2.41 52.32,2.41 | 52.32,2.41 52.7,2.41 54.61,2.41 56.26,2.41 57.91,2.41 62.23,2.41 64.14,2.41 67.82,2.41 69.47,2.41 75.56,2.41 77.72,2.41 89.92,2.41 91.57,2.41 99.31,2.41 arc90 99.95,3.05 R1.1 | LED1.AN 42.04,3.31 arc45 42.22,2.86 42.67,2.41 | LED2.AN 45.21,3.44 arc45 45.4,2.99 45.97,2.41 | LED3.AN 48.39,3.31 arc45 48.57,2.86 49.02,2.41 | LED4.AN 51.56,3.44 arc45 51.75,2.99 52.32,2.41 | U$35.1 51.36,31.4 arc-45 51.58,31.5 C28.1 | C9.1 60.66,20.28 arc45 v60.45,20.19 | LED6.AN 40.43,43.62 arc-45 40.33,43.4 LED7.AN 37.94,41 arc45 37.85,40.78 37.85,32.15 arc45 37.94,31.93 LED8.AN 39.02,28.42 arc45 39.12,28.19 40.01,27.3 41.91,27.3 arc-45 42.13,27.21 43.8,25.54 arc45 44.02,25.45 U$35.1 | U$35.1 47.93,27.97 arc-45 48.15,28.07 v58.42,28.07
  Top 1.016: C6.1 36.7,10.54 arc45 36.93,10.64 38.13,11.85 arc-45 38.36,11.94 45.59,11.94 arc45 45.81,12.03 arc45 46.03,12.12 53.92,20.01 arc-45 54.37,20.19 v55.88,20.19 | v67.06,29.08 69.66,31.69 arc45 69.85,32.14 v69.85,34.42 | v85.47,26.8 93.85,26.8 arc-90 94.49,26.16 94.49,20.33 arc-45 94.3,19.88 PROG_2.VDD | v83.31,30.23 81.16,30.23 arc-45 80.71,30.41 77.02,34.1 arc45 76.57,34.29 v72.39,34.29
  Bottom 0.508: v54.86,14.86 54.86,13.72 arc45 55.05,13.28 55.31,13.01 arc45 55.76,12.83 59.17,12.83 arc45 59.62,13.01 60.14,13.53 arc45 60.33,13.98 v60.33,14.48
  Bottom 0.762: v58.42,28.07 65.91,28.07 arc45 66.13,28.16 v67.06,29.08
  Bottom 1.016: v67.06,29.08 65.59,27.62 arc45 65.41,27.17 65.41,20.83 arc-90 64.77,20.19 v60.45,20.19 v55.88,20.19 | v83.31,30.23 85.28,28.25 arc-45 85.47,27.8 v85.47,26.8 | v69.85,34.42 arc45 70.16,34.29 v72.39,34.29
  pour Top (no thermals): 19.18,14.22 21.46,14.22 arc-45 21.68,14.13 22.35,13.46 22.77,13.05 arc45 22.99,12.95 25.53,12.95 26.92,12.95 arc-45 27.14,12.86 27.56,12.45 28.23,11.78 arc45 28.45,11.68 29.34,11.68 30.48,11.68 arc-45 30.7,11.59 30.73,11.56 30.89,11.4 arc45 31.12,11.3 33.27,11.3 33.78,11.3 arc-90 34.04,11.05 34.04,9.78 arc-90 33.91,9.65 32.26,9.65 arc-45 32.04,9.74 31.62,10.16 31.08,10.7 arc45 30.86,10.79 29.59,10.79 28.2,10.79 arc-45 27.97,10.89 27.81,11.05 27.4,11.46 arc45 27.17,11.56 26.29,11.56 22.99,11.56 arc45 22.77,11.46 22.23,10.92 21.81,10.51 arc-45 21.59,10.41 20.19,10.41 18.8,10.41 arc-90 18.67,10.54 18.67,14.1 arc-90 18.8,14.22
5V
  Top 0.762: JP9.3 6.1,27.16 arc90 5.46,26.53 5.46,21.72 10.23,16.95 arc45 10.68,16.76 12.32,16.76 | 12.32,16.76 15.37,16.76 | 15.37,16.76 23.61,16.76 arc-45 24.06,16.58 P4.3 | 105.28,21.08 arc90 104.65,21.72 | 105.28,21.08 105.28,1.65 arc-90 104.65,1.02 14.35,1.02 arc-90 13.72,1.65 13.72,15.37 arc90 12.32,16.76 | 15.37,16.76 arc90 13.72,15.11 | JP10.3 104.65,34.43 arc-90 105.28,33.8 105.28,22.35 | 105.28,21.08 105.28,22.35 | 104.65,21.72 R3.2 | 104.65,21.72 arc90 105.28,22.35
  pour Top (no thermals): 33.02,20.7 33.85,20.7 arc-90 34.16,20.38 34.16,16.38 34.16,15.75 arc-90 33.91,15.49 32.14,15.49 arc45 31.91,15.4 31.5,14.99 31.08,14.57 arc-45 30.86,14.48 29.46,14.48 28.83,14.48 arc45 28.61,14.38 28.57,14.35 28.29,14.06 arc-45 28.06,13.97 26.54,13.97 25.02,13.97 25.02,15.24 arc-90 25.15,15.37 28.44,15.37 arc45 28.67,15.46 28.83,15.62 31.28,18.07 arc45 31.37,18.29 31.37,19.18 31.37,20.38 arc-90 31.69,20.7 32.51,20.7
12V
  Top 1.016: C20.1 arc90 81.58,43.69 C22.1 | D1.C 98.79,51.05 arc-45 99.24,50.86 JP11.1
  Top 1.27: D1.C arc45 93.7,51.05 90.05,51.05 arc45 89.82,50.96 87.98,49.12 arc45 87.88,48.89 87.88,46.87 arc-45 87.79,46.64 84.93,43.78 arc-45 84.7,43.69 C22.1 | P5.1 77.12,45.31 arc45 77.57,45.12 C20.1
  pour Top (no thermals): 75.95,46.23 77.85,46.23 arc-90 77.98,46.1 77.98,44.96 arc-90 77.72,44.7 73.28,44.7 arc-90 72.64,45.34 72.64,49.53 arc90 72.01,50.16 23.75,50.29 arc-90 23.11,50.8 23.11,52.58 arc-90 23.75,53.09 73.91,53.09 arc-90 74.55,52.45 74.55,47.62 arc90
CTS  (via drill 0.6)
  Top 0.254: v72.9,19.56 72.9,21.97 arc45 72.81,22.19 v72.26,22.73 | v68.45,26.29 61.5,33.24 arc-45 61.41,33.47 U$35.12 | U$1.55 72.91,17.37 arc45 v72.9,17.4
  Bottom 0.254: v72.9,17.4 v72.9,19.56 | v72.26,22.73 72.14,22.73 arc-45 71.92,22.83 v68.45,26.29
FORCE  (via drill 0.6)
  Top 0.254: R16.2 68.14,7.21 arc45 68.37,7.11 v73.91,7.11 | v76.45,11.68 arc-45 76.41,11.79 U$1.62
  Top 0.508: JP4.2 70.6,4.62 arc45 70.5,4.85 R16.2
  Bottom 0.254: v73.91,7.11 76.36,9.56 arc45 76.45,9.78 v76.45,11.68
GND1  (via drill 0.6, 1.6)
  Top 0.508: v89.28,37.72 89.09,37.72 D13.5 88.01,37.21 arc-90 87.38,36.7 85.85,36.7 | C25.2 82.3,36.7 84.96,36.7 | 84.96,36.7 85.85,36.7 | 84.96,36.7 arc90 85.47,37.21 | D13.7 85.47,37.08 arc90 85.85,36.7 | R11.1 21.34,43.65 arc-45 21.12,43.56 v20.19,43.56 | R15.1 88.86,42.38 arc90 v88.65,42.16
  Top 0.762: v88.65,42.16 88.65,42.97 arc-45 88.74,43.19 M1.S
  Top 1.524: P5.4 70.61,47.75 v70.61,43.94
  Bottom 0.508: v20.19,43.56 19.91,43.85 arc45 19.68,43.94 19.56,43.94
  other vias: 85.22,47.75
  pour Top (no thermals): 84.71,49.02 arc-90 86.49,47.75 arc-90 84.96,46.48 83.31,46.48 83.31,49.02
  pour Top (no thermals): 82.04,49.02 78.87,49.02 arc90 77.6,47.75 arc90 78.99,46.61 82.04,46.48
  pour Top (no thermals): 81.41,49.02 83.95,49.02 83.95,46.48 81.41,46.48
  pour Top (no thermals): 77.34,48.39 76.42,48.39 arc90 76.2,48.17 76.2,47.45 arc90 76.39,47.26 77.62,47.26 arc-90 78.23,47.16 arc90 78.93,46.46 81.33,46.33 arc-90 81.83,45.83 83.52,45.83 arc-90 83.53,45.82 83.53,46.23 arc-90 83.85,46.55 83.85,48.51 arc90 83.45,48.91 83.45,49.96 arc90 83.43,49.99 81.93,49.99 arc-90 81.89,50.03 81.89,49.26 arc-90 81.57,48.95 78.55,48.95 arc90 78.16,48.55 78.16,48.45 arc-90 77.95,48.25
  pour Bottom (no thermals): 7.24,49.66 6.86,49.66 arc90 6.22,49.02 6.22,47.88 6.22,47.76 arc45 6.41,47.31 11.81,41.91 12.64,41.08 arc45 13.09,40.89 24.64,40.89 29.33,40.89 arc45 29.78,41.08 34.04,45.34 38.04,49.34 arc-45 38.49,49.53 64.64,49.53 68.2,49.53 arc-90 68.83,48.9 68.83,43.56 68.83,37.47 arc90 69.47,36.83 85.09,36.83 92.32,36.83 arc45 92.77,37.02 97.54,41.78 103.45,47.69 arc45 103.63,48.14 103.63,49.4 103.63,52.7 arc90 103,53.34 97.92,53.34 14.87,53.34 arc45 14.42,53.15 12.19,50.93 11.11,49.84 arc-45 10.66,49.66 7.75,49.66
GND2  (via drill 0.6, 1.2)
  Top 0.254: IMU2.11 59.55,5.82 arc45 59.64,5.59 C17.2 | IMU2.1 55.27,9.51 arc-45 55.05,9.6 v54.86,9.78 | IMU2.17 62.1,9.01 | 62.1,9.01 63.01,9.01 arc45 C18.2 63.25,11.72 arc-45 63.34,11.94 C19.2 | IMU2.15 61.78,8.01 arc90 62.1,8.32 62.1,9.01 | IMU2.18 61.78,9.51 arc-90 62.1,9.19 62.1,9.01 | U$1.9 81.95,19.3 arc-45 82.18,19.21 C12.2 | U$1.41 65.3,18.8 arc45 65.07,18.71 C14.2 | U$1.25 73.41,26.91 arc-45 73.5,27.14 C11.2 | U$1.20 75.91,26.12 arc-45 76,26.35 77.21,27.55 arc-45 77.44,27.65 C7.2
  Top 0.508: C27.2 v50.67,20.19 | v44.7,15.11 arc45 44.74,15.19 44.74,15.91 arc-90 45.21,16.38 D15.5 | D15.5 44.2,16.38 arc-90 44.7,15.88 44.7,15.62 arc90 44.74,15.65 D15.5 | D13.4 88.01,31.72 arc45 88.2,31.27 C24.2 89.65,30.86 arc45 90.1,31.05 v90.68,31.62 | C17.2 arc45 60.99,4.35 v62.1,3.81 | C19.2 64.26,12.06 arc-45 64.48,11.97 v64.77,11.68 | C8.2 C13.2 C2.- 70.45,8.55 arc-45 70.23,8.64 v69.6,9.27 67.91,9.27 arc-45 67.69,9.36 R16.1 | C12.2 C1.2 87.04,18.58 arc45 v87.25,18.67 | C11.2 74.5,30.2 arc-45 C10.2 74.51,31.58 arc-45 74.6,31.8 C15.2 76.45,32.38 arc-45 76.67,32.29 v77.09,31.88 | C16.2 55.41,5.42 arc45 55.32,5.64 v55.12,5.84 | v61.09,18.29 61.29,18.49 arc-45 61.51,18.58 C9.2 C14.2 | R2.2 94.4,10.07 arc-45 94.49,10.29 v94.61,10.41 | C7.2 81.19,27.65 arc-45 81.41,27.55 v81.66,27.3 | LED5.CAT 41.04,28.67 arc45 41.26,28.57 v42.93,28.57
  Top 0.762: C28.2 57.23,31.5 arc-45 57.45,31.4 U$35.10
  Bottom 0.254: v54.86,9.78 arc45 54.77,10 54.61,10.16
  Bottom 0.508: v50.67,20.19 50.67,20.32 | v44.7,15.11 45.08,15.11 arc-45 45.3,15.02 45.47,14.86 | v90.68,31.62 90.93,31.37 | v62.1,3.81 arc-45 62.19,4.41 62.23,4.45 | v64.77,11.68 64.77,11.18 | v87.25,18.67 87.37,18.67 arc45 87.6,18.76 87.63,18.8 | v55.12,5.84 55.12,6.22 | v61.09,18.29 61.09,18.16 | v94.61,10.41 arc-45 94.83,10.32 94.87,10.29 | v69.6,9.27 69.6,9.4 | v77.09,31.88 arc-45 77,31.66 76.96,31.62 | v81.66,27.3 81.78,27.3 arc45 82.01,27.4 82.04,27.43 | v42.93,28.57 42.96,28.61 arc-45 43.18,28.7
  other vias: 35.31,13.34 35.18,7.49
  pour Bottom (no thermals): 21.72,20.57 24,20.57 24,18.29 21.72,18.29
  pour Bottom: 15.11,39.62 4.95,39.62 arc90 4.32,38.99 4.32,37.21 4.32,1.52 arc90 4.95,0.89 12.06,0.89 103.38,0.89 arc90 104.01,1.52 104.01,14.35 104.01,34.54 arc90 103.38,35.18 89.53,35.18 66.8,35.18 arc-90 66.17,35.81 66.17,40.64 66.17,47.75 arc90 65.53,48.39 47.62,48.39 42.17,48.39 arc45 41.72,48.2 36.96,43.43 33.33,39.81 arc-45 32.88,39.62 15.49,39.62
  pour Bottom: 103.89,30.48 103.89,39.24 arc90 103.25,39.88 101.35,39.88 98.69,39.88 arc45 98.24,39.69 95.12,36.58 93.91,35.37 arc-45 93.46,35.18 89.15,35.18 93.67,30.67 arc45 94.12,30.48 102.87,30.48
  pour Top (no thermals): 29.34,13.72 31.11,13.72 arc45 31.34,13.81 31.37,13.84 31.66,14.13 arc-45 31.88,14.22 33.4,14.22 35.43,14.22 arc-90 36.32,13.34 arc-90 35.31,12.32 29.21,12.32 arc-90 28.96,12.57 28.96,13.59 arc-90 29.08,13.72
  pour Top (no thermals): 25.78,10.79 26.79,10.79 arc-45 27.02,10.7 27.3,10.41 27.59,10.13 arc45 27.82,10.03 29.34,10.03 29.84,10.03 arc-45 30.07,9.94 30.99,9.02 31.4,8.6 arc45 31.63,8.51 33.02,8.51 35.18,8.51 arc-90 36.2,7.49 arc-90 35.18,6.48 31.75,6.48 arc-45 31.53,6.57 30.1,8 29.3,8.8 arc45 29.08,8.89 26.54,8.89 25.27,8.89 arc-90 25.02,9.14 25.02,10.67 arc-90 25.15,10.79
IMU_INT2  (via drill 0.6)
  Top 0.254: IMU2.12 61.27,6.28 arc-45 61.72,6.09 v62.1,5.71 | U$1.35 69.53,21.8 arc-90 69.85,21.48 v69.85,19.18 | v69.85,17.14 69.85,15.88 arc-45 69.76,15.65 65.88,11.78 arc45 65.79,11.55 65.79,10.79 65.79,9.78 65.79,6.03 arc-90 65.47,5.71 v64.39,5.71
  Bottom 0.254: v62.1,5.71 v64.39,5.71 | v69.85,17.14 v69.85,19.18
LED1
  Top 0.254: U$1.43 66.07,17.8 arc45 65.62,17.61 65.53,17.53 arc-45 65.22,17.4 53.86,17.4 arc45 53.41,17.21 46.54,10.35 arc-45 46.09,10.16 43.61,10.16 arc45 43.16,9.97 R4.1
LED2
  Top 0.254: U$1.44 66.33,17.3 arc45 65.88,17.11 65.79,17.02 arc-45 65.48,16.89 53.98,16.89 arc45 53.53,16.7 45.87,9.04 arc-45 45.42,8.85 R5.1
LED3
  Top 0.254: U$1.45 66.56,16.8 arc45 66.17,16.64 66.1,16.57 arc-45 65.65,16.38 54.24,16.38 arc45 53.79,16.2 48.57,10.98 arc45 48.39,10.53 R6.1
LED4
  Top 0.254: U$1.46 66.98,16.3 arc45 66.53,16.11 66.42,16 arc-45 66.11,15.88 54.49,15.88 arc45 54.04,15.69 51.75,13.39 arc45 51.56,12.95 R7.1
LOW_MAG
  Top 0.254: D13.2 85.47,31.69 arc-90 85.15,31.37 83.7,31.37 arc-45 83.25,31.55 79.81,34.99 arc45 79.37,35.18 71.55,35.18 arc90 70.91,34.54 U$1.30
LOW_MAGA
  Top 0.254: U$1.23 74.41,26.27 arc-45 74.5,26.5 77,28.99 arc-45 77.22,29.08 93.61,29.08 arc45 93.83,29.18 JP10.2
LOW_MAGB
  Top 0.254: U$1.22 74.91,26.14 arc-45 75,26.36 77.12,28.48 arc-45 77.35,28.57 97.1,28.57 arc45 97.33,28.67 JP10.4
MCLR_2
  Top 0.254: U$1.7 81.26,18.3 arc-45 81.49,18.21 82.08,17.62 arc45 82.3,17.53 88.26,17.53 arc-45 88.48,17.43 PROG_2.MCLR 95.3,14.48 arc-45 95.52,14.38 RESET2.1
  Top 0.508: RESET2.1 R1.2
MOTA  (via drill 0.6)
  Top 0.254: U$1.34 44.96,22.3 44.63,22.3 42.35,22.3 arc-45 42.12,22.39 v41.27,23.24
  Bottom 0.254: JP9.2 39.22,25.16 arc-45 39.45,25.07 v41.27,23.24
MOTB  (via drill 0.6)
  Top 0.254: v42.29,24.89 44.29,22.89 arc45 44.51,22.8 U$1.33
  Bottom 0.254: JP9.4 10.27,26.25 arc45 10.5,26.16 40.89,26.16 arc-45 41.11,26.07 v42.29,24.89
N$2
  Top 0.254: U$1.56 73.41,12.67 arc-45 73.32,12.45 C2.+
N$3
  Top 0.508: JP3.2 arc45 101,24.95 R3.1
N$6
  Top 0.508: LED4.CAT R7.2
N$7
  Top 0.508: LED3.CAT R6.2
N$8
  Top 0.508: LED2.CAT R5.2
N$9
  Top 0.508: LED1.CAT R4.2
N$11
  Top 0.254: IMU2.10 59.05,4.62 arc45 59.14,4.39 C17.1
N$12
  pour Top (no thermals): 33.66,47.88 31.81,47.88 arc90 31.5,47.56 31.5,43.56 31.5,41.21 arc90 31.81,40.89 32.77,40.89 35.5,40.89 arc90 35.81,41.21 35.81,44.07 35.81,47.56 arc90 35.5,47.88 34.16,47.88
N$13
  pour Top (no thermals): 23.75,47.88 29.97,47.88 arc-90 30.35,47.5 30.35,45.59 arc-90 30.1,45.34 25.4,45.34 arc90 24.89,44.83 24.89,43.94 arc-90 24.64,43.69 23.62,43.69 arc-90 23.37,43.94 23.37,45.85 arc90 23.62,45.97 23.37,45.97 arc-90 23.37,46.23 23.37,47.62 arc-90
N$14
  Top 0.254: IMU2.20 59.55,11.43 arc-90 60.19,12.06 C19.1
  Top 0.762: C19.1 61.72,12.06 arc-90 61.59,12.19
N$15  (via drill 0.6)
  Top 0.508: C25.1 82.3,38.73 arc-90 82.36,38.8 83.54,38.82 arc90 84.23,39.51 84.23,38.14 arc-90 84.2,38.09 84.15,38.34 arc90 83.6,38.81 84.19,38.81 arc-90 D13.8
  Top 0.762: 82.36,38.8 arc-90 82.3,38.85 v82.3,41.91 | C23.1 86.35,52.2 arc-45 86.8,52.01 v87.38,51.44
  Top 1.016: P5.3 arc-90 77.25,50.38 C21.1 arc-90 82.85,52.07 C23.1
  Bottom 0.762: v87.38,51.44 arc-90 88.65,50.16 88.65,45.09 arc-90 87.38,43.81 82.8,43.81 arc90 82.3,43.31 v82.3,41.91
N$17
  Top 0.508: D13.6 86.74,39.88 | 86.74,39.88 86.74,41.4 | 86.74,41.4 86.74,42.97 arc-45 86.83,43.19 M1.G | 86.74,41.4 arc90 87.46,40.68 | R15.2 87.54,40.68 arc90 86.74,39.88
N$18
  Top 0.762: M1.D 92.07,45.09 arc90 D1.A
  Top 1.016: D1.A 98.79,46.74 arc45 99.24,46.93 JP11.2
N$19
  Top 0.254: JP13.4 11.04,36.03 arc45 11.26,35.94 22.35,35.94 arc-45 22.57,35.85 34.07,24.35 arc45 34.29,24.26 37.55,24.26 arc-45 37.77,24.16 C26.1
  Top 0.508: C26.1 39.08,20.58 arc45 39.17,20.36 D15.1
N$20
  Top 0.254: JP13.3 9.8,35.27 arc45 10.02,35.18 22.09,35.18 arc-45 22.32,35.09 36.74,20.67 arc-45 36.83,20.44 36.83,19.24 arc90 37.15,18.92 D15.2
N$21
  Top 0.254: JP13.2 8.56,34.51 arc45 8.78,34.42 21.84,34.42 arc-45 22.06,34.32 35.85,20.54 arc-45 35.94,20.32 35.94,17.97 arc90 36.26,17.65 D15.3
N$22  (via drill 0.6)
  Top 0.254: D15.4 38.61,16.38 35.37,16.38 arc-90 35.05,16.7 35.05,20.45 21.89,33.61 arc45 21.66,33.7 JP13.1
  Top 0.508: C26.2 37.38,21.68 arc45 37.47,21.46 v37.85,21.08 | v37.85,15.24 37.85,15.62 arc-90 38.61,16.38
  Bottom 0.508: v37.85,15.24 v37.85,21.08
N$23  (via drill 0.6)
  Top 0.508: R10.2 47.97,32.81 arc45 48.06,32.59 v49.28,31.37
  Bottom 0.508: v49.28,31.37 49.35,31.37 arc-45 49.58,31.28 U$35.6
N$24
  pour Top (no thermals): 16.89,52.83 6.73,52.83 arc90 6.1,52.2 6.1,50.55 arc90 6.73,49.91 9.26,49.91 arc-45 9.71,49.73 13.4,46.03 arc45 13.85,45.85 21.21,45.85 arc90 21.59,45.97 21.59,52.45 arc90 21.21,52.7
N$25
  Top 0.508: U$35.20 48,44.85 arc-45 48.09,44.63 R12.1
N$26
  Top 0.508: R13.1 49.35,41.53 arc45 49.58,41.62 U$35.15
N$27
  Top 0.508: R14.1 48.78,36.96 arc45 49.01,37.05 U$35.13
N$28
  Top 0.508: LED5.AN 46.08,34.72 arc-45 R10.1
N$29
  Top 0.508: LED6.CAT 42.86,43.72 arc-45 43.08,43.81 R12.2
N$30
  Top 0.508: LED7.CAT 45.53,40.92 arc45 45.75,41.01 R13.2
N$31
  Top 0.508: LED8.CAT 45.17,36.86 arc-45 45.4,36.96 R14.2
PGEC1_2
  Top 0.254: PROG_2.PGEC 77.52,24.64 arc-90 U$1.17
PGED1_2
  Top 0.254: PROG_2.PGED 90.01,23.53 arc45 89.78,23.62 77.23,23.62 arc-90 76.91,23.94 U$1.18
RTS  (via drill 0.6)
  Top 0.254: v71.37,19.56 71.37,21.33 arc45 71.28,21.56 v70.61,22.23 | v67.06,25.4 53.5,38.96 arc-45 v53.41,39.18 | U$1.54 72.41,16.23 arc45 72.32,16.46 v71.37,17.4
  Bottom 0.254: v71.37,17.4 v71.37,19.56 | v70.61,22.23 70.36,22.23 arc-45 70.14,22.32 v67.06,25.4 | v53.41,39.18 U$35.16
RX1
  Top 0.254: U$1.31 70.41,23.69 arc-90 70.09,23.37 49.62,23.37 arc-45 49.39,23.46 U$35.2
RX2  (via drill 0.6)
  Top 0.254: U$1.50 70.41,11.87 arc-45 70.32,11.64 70.23,11.56 70.1,11.43 69.82,11.14 arc-45 69.59,11.05 v68.96,11.05 | D15.6 45.46,17.65 arc-45 45.69,17.56 v47.5,15.75
  Bottom 0.254: v47.5,15.75 47.5,2.1 arc90 47.82,1.78 66.99,1.78 arc90 67.31,2.1 67.31,9.27 arc-45 67.4,9.49 v68.96,11.05
SCK2  (via drill 0.6)
  Top 0.254: U$1.4 80.73,16.8 arc-45 80.96,16.71 81.82,15.84 arc-45 81.92,15.62 81.92,11.82 arc45 82.01,11.59 82.97,10.63 arc45 83.19,10.54 v83.57,10.54
  Bottom 0.254: U$51.2 83.47,8.75 arc45 83.57,8.97 v83.57,10.54
SCL1  (via drill 0.6)
  Top 0.254: IMU2.23 58.05,11.42 arc-45 58.14,11.65 R9.1 58.23,12.43 arc-90 57.91,12.75 57.91,14.09 arc-45 58.01,14.32 v58.67,14.99 | U$1.37 66.45,20.8 arc-45 66.23,20.89 65.88,21.24 arc45 65.65,21.34 59.56,21.34 arc90 58.93,20.7 v58.93,18.29
  Bottom 0.254: v58.67,14.99 58.67,17.9 arc-45 58.77,18.13 v58.93,18.29
SDA1  (via drill 0.6)
  Top 0.254: IMU2.24 57.55,11.14 arc45 57.46,11.36 R8.1 57.09,12.43 arc90 57.4,12.75 57.4,14.47 arc45 57.31,14.7 v57.02,14.99 | U$1.36 66.59,21.3 arc-45 66.36,21.39 66.01,21.75 arc45 65.78,21.84 57.72,21.84 arc90 57.15,21.27 v57.15,18.29
  Bottom 0.254: v57.02,14.99 57.02,18.03 arc-45 57.12,18.25 v57.15,18.29
SDI2  (via drill 0.6)
  Top 0.254: U$1.5 80.99,17.3 arc-45 81.22,17.21 82.46,15.97 arc-45 82.55,15.74 82.55,12.13 arc90 82.87,11.81 84.33,11.81 85.25,10.89 arc-45 85.34,10.66 v85.34,9.78
  Bottom 0.254: v85.34,9.78 85.34,8.75 arc-45 85.25,8.53 U$51.3
SDO2  (via drill 0.6)
  Top 0.254: U$1.6 81.13,17.8 arc-45 81.35,17.71 83.09,15.97 arc-45 83.19,15.74 83.19,12.64 arc90 83.5,12.32 v86.74,12.32
  Bottom 0.254: v86.74,12.32 86.74,8.15 arc-45 86.65,7.92 U$51.4
SS2  (via drill 0.6)
  Top 0.254: U$1.3 80.47,16.3 arc-45 80.69,16.21 81.03,15.88 v81.03,12.83 | v84.07,16.51 87.82,16.51 arc-90 88.14,16.19 v88.14,8.51
  Bottom 0.254: v88.14,8.51 88.14,7.54 arc-45 88.05,7.32 U$51.5 | v81.03,12.83 81.03,13.46 arc-45 81.12,13.68 v84.07,16.51
TX1
  Top 0.254: U$35.3 50.88,23.97 arc45 51.11,23.88 67.69,23.88 arc45 67.91,23.97 68.61,24.67 arc-45 68.84,24.77 69.89,24.77 arc-90 U$1.32
TX2  (via drill 0.6)
  Top 0.254: D15.7 46.86,18.92 arc-45 47.08,18.83 v48.77,17.14 | v67.31,11.81 68.76,13.26 arc-45 68.98,13.35 U$1.49
  Bottom 0.254: v48.77,17.14 48.77,2.73 arc90 49.09,2.41 66.23,2.41 arc90 66.55,2.73 66.55,10.92 arc-45 66.64,11.14 v67.31,11.81
USER
  Top 0.254: U$1.42 74.15,18.3 arc-45 74.38,18.21 84.87,7.71 arc45 85.09,7.62 92.07,7.62 arc-45 92.3,7.53 94.39,5.43 arc45 94.62,5.33 USER.2
  Top 0.508: USER.2 97.23,7.12 arc45 97.14,7.34 R2.1

### Text on the board
tPlace: LM2937(3.3V) | Magnet | 12V | ES | 1B | SK | GND | SMB | 592 | 34A | ON/OFF | SOT | 23F | ASSOC | 10uF | AOD4189 | .1uF | 1k | 100k | Bottom | 2 | 1 | 1k | 1k | Magnet | 3 | 3.3V | CC6-1205SF-E | .1uF | _ | GND1 | RX | SI8610 | EC-B-IS | 1k | A | TX | 1k | + | GND | .1uF | SLEEP | 10uF | B | .1uF | .1uF | .1uF | _ | B | .01uF | + | RSSI | + | Motor | A | .1uF | .1uF | 3 LED | _ | 4 | 6 | ISO7221 | .01uF | 5.1 | 5 | 7 | .1uF | dsPIC33EP | 512MC806 | Gyro | Accel | Mag | .1uF | X | .01uF | X | 2.2nF | 10k | 10k | Y | Y | .01uF | 1k | 1k | 1k | 1k | RESET | Z | Z | .1uF | 2.2k | MPU | 3k | .1uF | 1117(3.3V) | 9150 | .1uF | 10uF | 10uF | 2.2k | Gibbot V8.S1 | 1 | 2 | 3 | 4 | 10nF | .1uF | GND2 | FORCE | USER | 3.3V | SCK | SDI | SDO | SS | GND